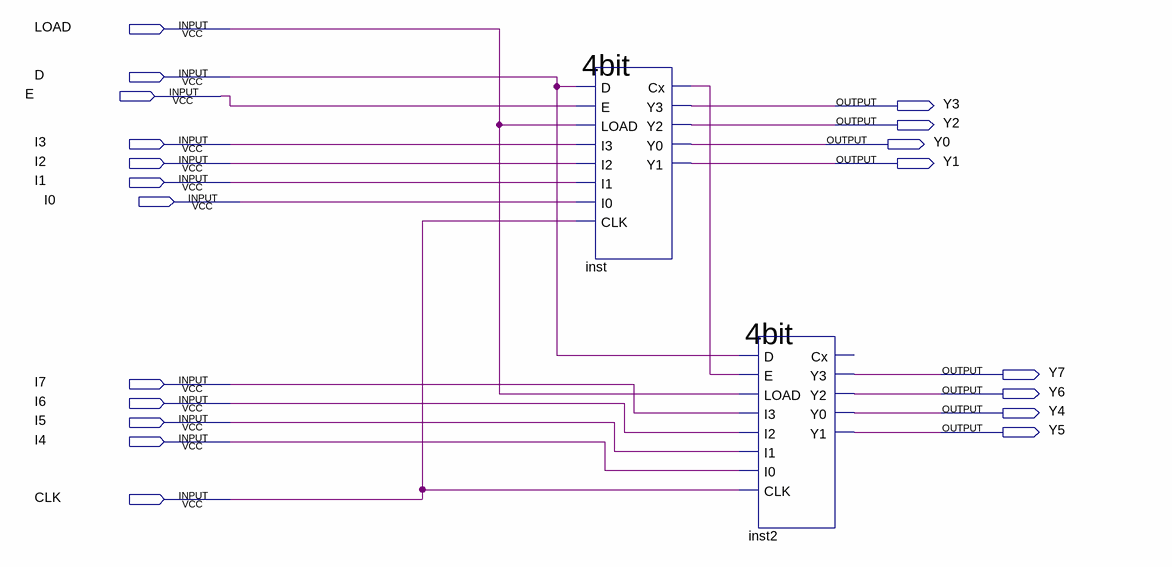
[diagram p0: schematic sheet]
// Quartus schematic up_down.bdf as structural Verilog: 2 symbols, 20 pins
module up_down (
  input  LOAD,
  input  D,
  input  E,
  input  I3,
  input  I2,
  input  I1,
  input  I0,
  input  I7,
  input  I6,
  input  I5,
  input  I4,
  input  CLK,
  output Y3,
  output Y2,
  output Y0,
  output Y1,
  output Y7,
  output Y6,
  output Y4,
  output Y5
);

  wire inst_cx;

  \4bit  inst (
    .D(D), .E(E), .LOAD(LOAD), .I3(I3), .I2(I2), .I1(I1), .I0(I0), .CLK(CLK), .Cx(inst_cx), .Y3(Y3), .Y2(Y2),
    .Y0(Y0), .Y1(Y1));
  \4bit  inst2 (
    .D(D), .E(inst_cx), .LOAD(LOAD), .I3(I7), .I2(I6), .I1(I5), .I0(I4), .CLK(CLK), .Y3(Y7), .Y2(Y6),
    .Y0(Y4), .Y1(Y5));  // open: Cx
endmodule
